# EAGLE design midi_board0.1 (EAGLE 5.10)
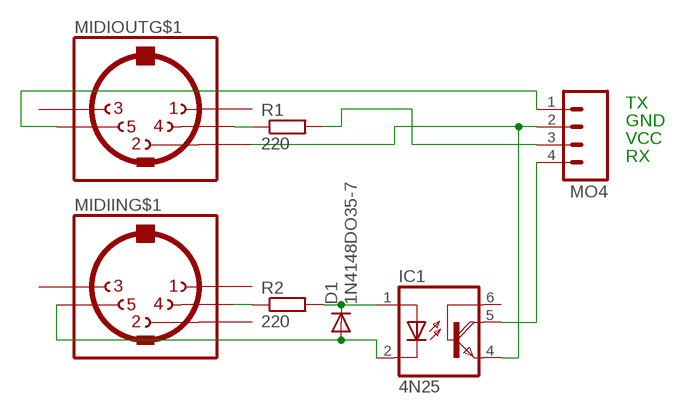
[diagram p0: schematic, sheet 1]

## Parts
D1  1N4148DO35-7  [DO35-7]
IC1  4N25  [DIL06]
MIDIIN  MIDIJACK  [CP-2350]
MIDIOUT  MIDIJACK  [CP-2350]
MO4  M041X04_NO_SILK  [1X04_NO_SILK]
R1  220  R-EU_0207/10  [0207/10]
R2  220  R-EU_0207/10  [0207/10]

## Nets
DIN_D1: D1.A IC1.2(C) MIDIIN.5
DIN_R1: MIDIOUT.4 R1.1
DIN_R2: MIDIIN.4 R2.1
MIDI_GND: IC1.4(E) MIDIOUT.2 MO4.2
MIDI_RX: IC1.5(COL) MO4.4
MIDI_TX: MIDIOUT.5 MO4.1
MIDI_VCC: MO4.3 R1.2
OP_R2: D1.C IC1.1(A) R2.2
Unconnected: IC1.6(B) MIDIIN.1 MIDIIN.2 MIDIIN.3 MIDIIN.PE1(MT) MIDIIN.PE2(MT) MIDIIN.PE(MT) MIDIIN.PE@(MT) MIDIOUT.1 MIDIOUT.3 MIDIOUT.PE1(MT) MIDIOUT.PE2(MT) MIDIOUT.PE(MT) MIDIOUT.PE@(MT)

## Notes on the sheet
- TX
- GND
- VCC
- RX

## Library data of the parts
D1 = diode:1N4148: DIODE high speed (Philips)
IC1 = 4N25:4N25: Optocoupler, Phototransistor Output, With Base Connection VISHAY SEMICONDUCTORS created by Peter.Hofmann@ph-tronic.de <mailto:Reter.Hofmann@ph-tronic.de> 01-2006 Rev.0
MIDIIN MIDIOUT = adafruit:MIDIJACK: DIN 5 jack also known as MIDI jack A modification of conn-hirshman:MAB5SH with two options for the grounding 'teeth'
MO4 = SparkFun:M04: Header 4 Standard 4-pin 0.1" header. Use with straight break away headers (SKU : PRT-00116), right angle break away headers (PRT-00553), swiss pins (PRT-00743), machine pins (PRT-00117), and female headers (PRT-00115). Molex polarized connector foot print use with SKU : PRT-08231 with associated crimp pins and housings.
R1 R2 = resistor:R-EU_: RESISTOR, European symbol

## Board
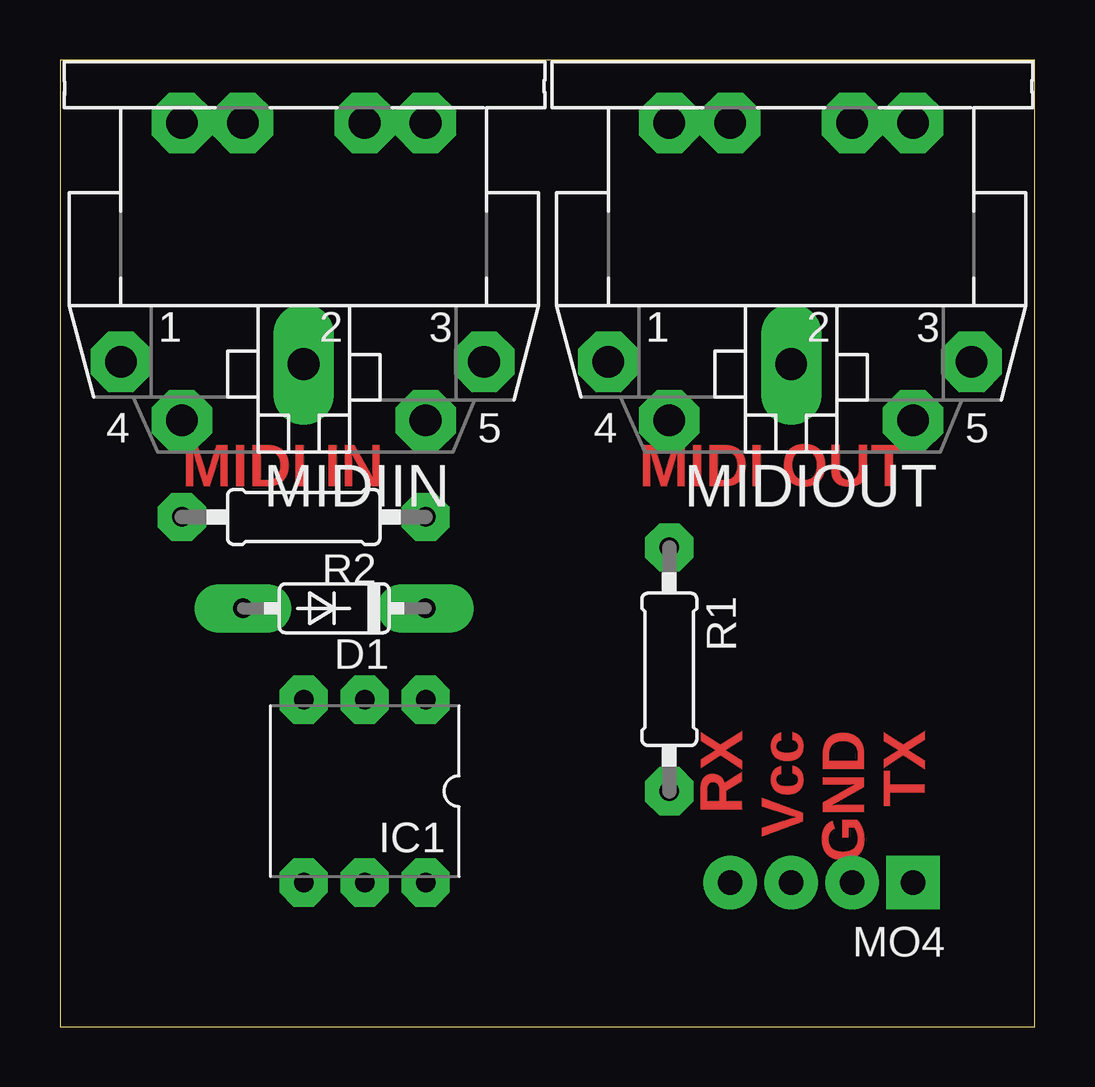
[diagram p1: board, top side]
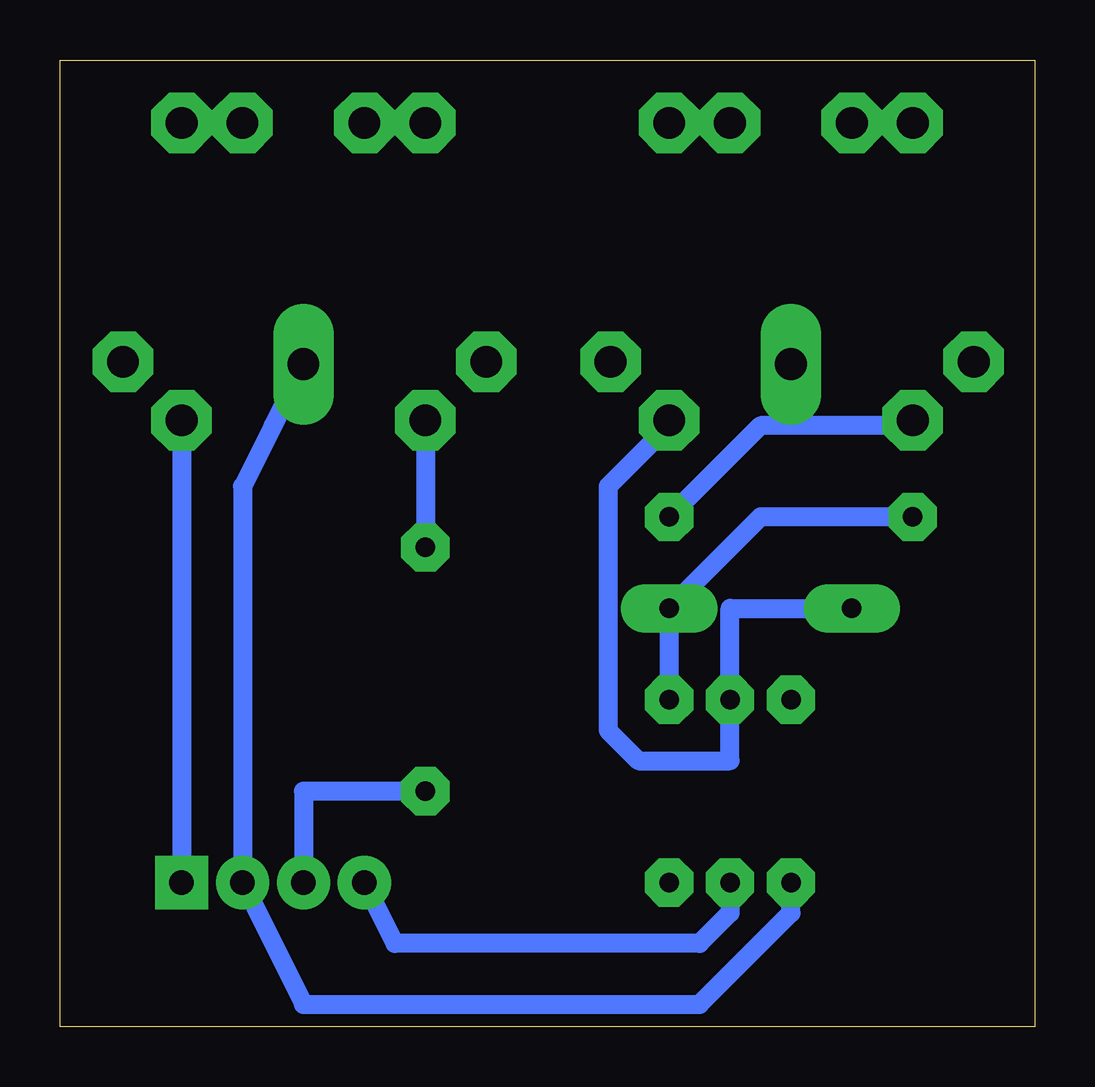
[diagram p2: board, bottom side, seen from below]

Size 40.63 x 40.31 mm. Coordinates in mm from the lower left corner, seen from the top.
Outline: 0,40.31 0,0 40.63,0 40.63,40.31 0,40.31
Copper layers (1*16): Top 0.035mm / dielectric 1.5mm / Bottom 0.035mm
Design rules "hobby": minimum track width 0.8mm, minimum drill 0.8mm, track to track 0.8mm, track to pad 0.8mm, pad to pad 0.45mm, via to via 0.8mm, smd to smd 8mil, copper to edge 10mil, drill to drill 8mil, minimum pad ring 0.6mm, minimum via ring 0.6mm, stop-mask expansion 0mil, vias tented up to drill 0mil, thermal gap 10mil

### Footprints (pad centres in the part's own frame; a part is rotated, then mirrored left to right if it is on the bottom)
DO35-7 = drill 0.813 long: A 3.81,0; C -3.81,0
DIL06 = drill 0.813 pad 1.422 octagon: 1 -2.54,-3.81; 2 0,-3.81; 3 2.54,-3.81; 4 2.54,3.81; 5 0,3.81; 6 -2.54,3.81
CP-2350 = drill 1.321 pad 2.184 octagon: 1 7.62,12.58; 3 -7.52,12.58; 4 5.08,15.02; 5 -5.08,15.02; PE -2.54,2.62; PE1 -5.08,2.62; PE2 5.08,2.62; PE@ 2.54,2.62 | drill 1.321 long: 2 0,12.68
1X04_NO_SILK = drill 1.016 pad 1.88 square: 1 0,0 | drill 1.016 pad 1.88 round: 2 2.54,0; 3 5.08,0; 4 7.62,0
0207/10 = drill 0.813 octagon: 1 -5.08,0; 2 5.08,0

### Placement (x,y rotation side)
D1  11.43,17.45 180 top
IC1  12.7,9.83 180 top
MIDIIN  10.16,40.31 180 top
MIDIOUT  30.48,40.31 180 top
MO4  35.56,6.02 180 top
R1  25.4,14.91 270 top
R2  10.16,21.26 180 top

### Tracks (layer width: path | path; a pad name or v marks a point on that pad's centre or on a via)
DIN_D1
  Bottom 0.8: D1.A 12.7,17.45 IC1.2 12.7,11.1 16.51,11.1 17.78,12.37 17.78,22.53 15.24,25.07 MIDIIN.5
DIN_R1
  Bottom 0.8: MIDIOUT.4 R1.1
DIN_R2
  Bottom 0.8: R2.1 11.43,25.07 5.08,25.07 MIDIIN.4
MIDI_GND
  Bottom 0.8: IC1.4 10.16,4.75 13.97,0.94 30.48,0.94 MO4.2 33.02,22.53 31.75,25.07 MIDIOUT.2
MIDI_RX
  Bottom 0.8: IC1.5 12.7,4.75 13.97,3.48 26.67,3.48 MO4.4
MIDI_TX
  Bottom 0.8: MIDIOUT.5 MO4.1
MIDI_VCC
  Bottom 0.8: R1.2 30.48,9.83 MO4.3
OP_R2
  Bottom 0.8: R2.2 11.43,21.26 D1.C IC1.1

### Text on the board
Top: MIDI IN | MIDI OUT | RX | Vcc | GND | TX